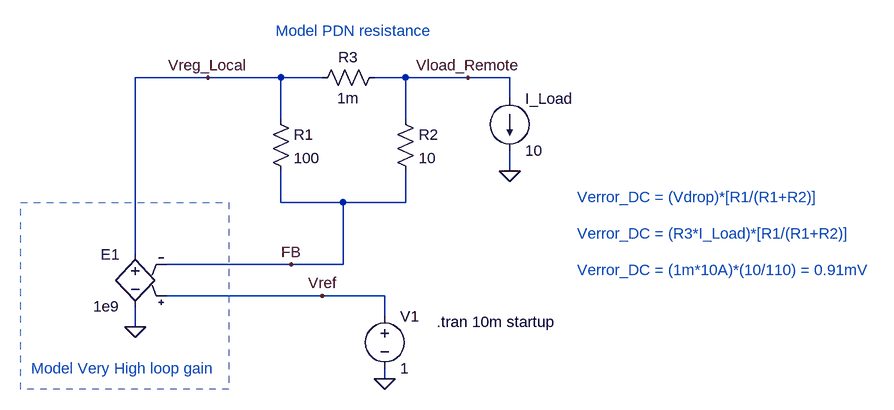
[diagram p0: schematic Remote_LoadReg_DC_Error.asc]
Remote_LoadReg_DC_Error.asc, the LTspice schematic file:
Version 4
SHEET 1 1748 680
WIRE 192 48 80 48
WIRE 304 48 192 48
WIRE 368 48 304 48
WIRE 496 48 448 48
WIRE 592 48 496 48
WIRE 656 48 592 48
WIRE 656 80 656 48
WIRE 304 112 304 48
WIRE 496 112 496 48
WIRE 656 192 656 160
WIRE 304 240 304 192
WIRE 400 240 304 240
WIRE 496 240 496 192
WIRE 496 240 400 240
WIRE 80 320 80 48
WIRE 320 336 128 336
WIRE 400 336 400 240
WIRE 400 336 320 336
WIRE 368 384 128 384
WIRE 464 384 368 384
WIRE 464 416 464 384
WIRE 80 432 80 400
WIRE 464 512 464 496
FLAG 656 192 0
FLAG 320 336 FB
FLAG 464 512 0
FLAG 80 432 0
FLAG 592 48 Vload_Remote
FLAG 368 384 Vref
FLAG 192 48 Vreg_Local
SYMBOL res 288 96 R0
SYMATTR InstName R1
SYMATTR Value 100
SYMBOL res 480 96 R0
SYMATTR InstName R2
SYMATTR Value 10
SYMBOL res 464 32 R90
WINDOW 0 0 56 VBottom 2
WINDOW 3 32 56 VTop 2
SYMATTR InstName R3
SYMATTR Value 1m
SYMBOL current 656 80 R0
WINDOW 123 0 0 Left 0
WINDOW 39 0 0 Left 0
SYMATTR InstName I_Load
SYMATTR Value 10
SYMBOL e2 80 304 M0
SYMATTR InstName E1
SYMATTR Value 1e9
SYMBOL voltage 464 400 R0
WINDOW 123 0 0 Left 0
WINDOW 39 0 0 Left 0
SYMATTR InstName V1
SYMATTR Value 1
TEXT 544 424 Left 2 !.tran 10m startup
TEXT -80 496 Left 2 ;Model Very High loop gain
TEXT 296 -24 Left 2 ;Model PDN resistance
TEXT 760 232 Left 2 ;Verror_DC = (Vdrop)*[R1/(R1+R2)]
TEXT 760 344 Left 2 ;Verror_DC = (1m*10A)*(10/110) = 0.91mV
TEXT 760 288 Left 2 ;Verror_DC = (R3*I_Load)*[R1/(R1+R2)]
RECTANGLE Normal 224 528 -96 240 2

The netlist it stands for:
* Remote_LoadReg_DC_Error.asc
R1 Vreg_Local FB 100
R2 Vload_Remote FB 10
R3 Vload_Remote Vreg_Local 1m
I_Load Vload_Remote 0 10
E1 Vreg_Local 0 Vref FB 1e9
V1 Vref 0 1
.tran 10m startup
* Model Very High loop gain
* Model PDN resistance
* Verror_DC = (Vdrop)*[R1/(R1+R2)]
* Verror_DC = (1m*10A)*(10/110) = 0.91mV
* Verror_DC = (R3*I_Load)*[R1/(R1+R2)]
.backanno
.end